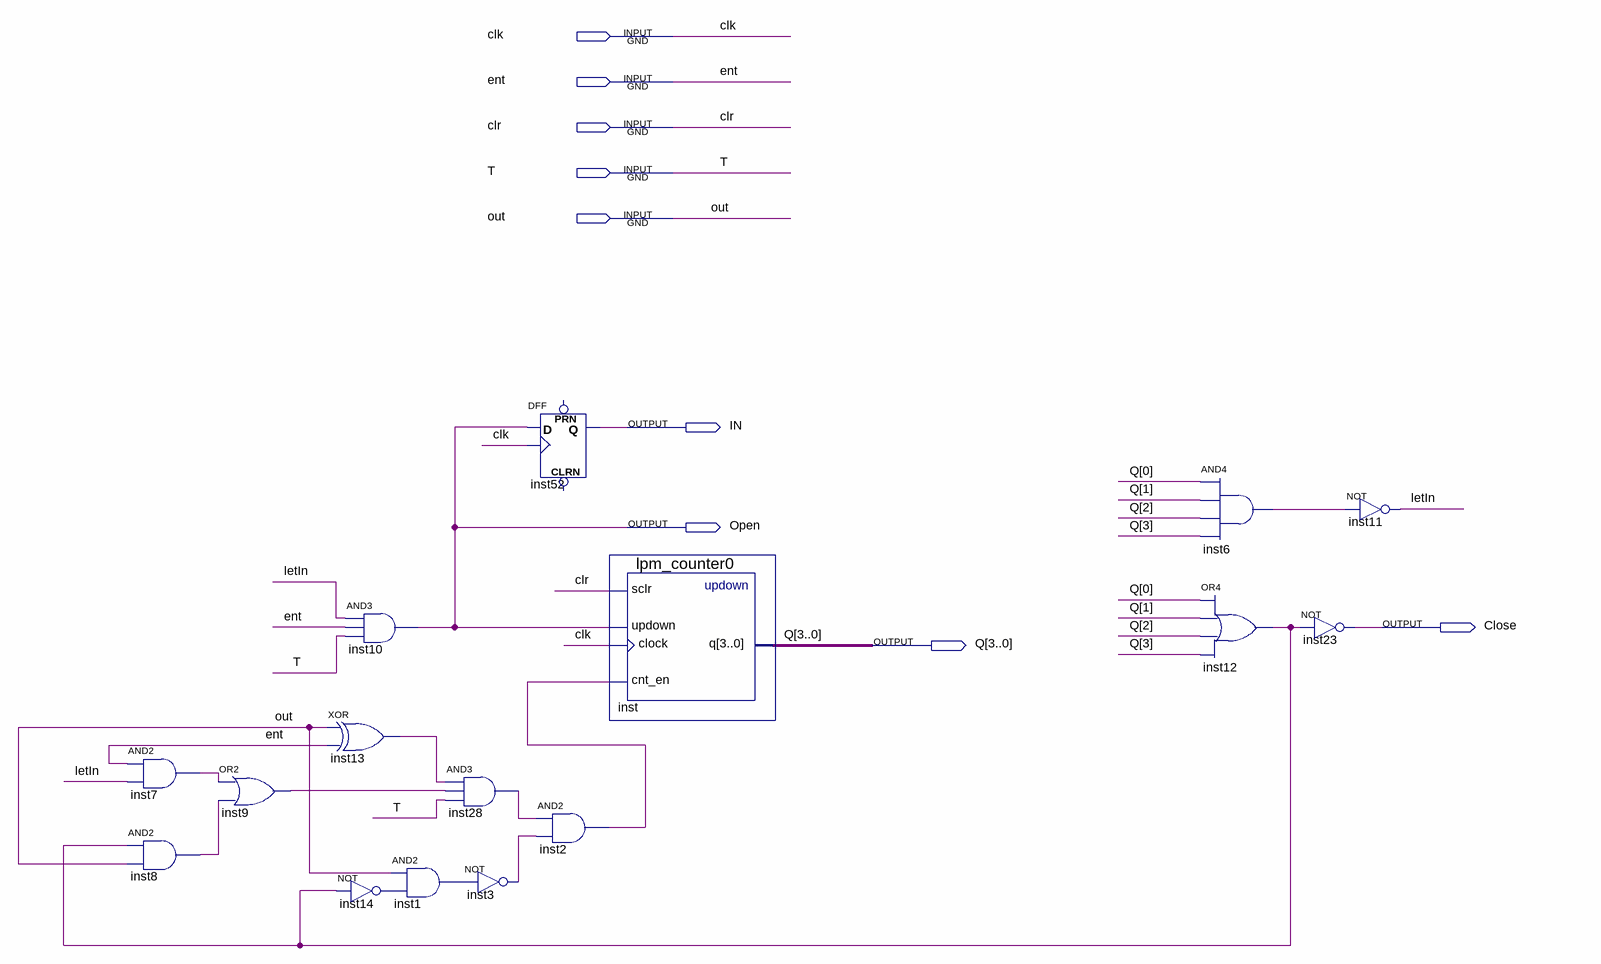
[diagram p0: schematic sheet]
// Quartus schematic main2.bdf as structural Verilog: 16 symbols, 9 pins
module main2 (
  input  clk,
  input  ent,
  input  clr,
  input  T,
  input  out,
  output IN,
  output Open,
  output Close,
  output [3:0] Q
);

  wire inst1_out, inst2_out, inst3_out, inst6_out, inst7_out, inst8_out, inst9_out, inst12_out, inst13_out,
       inst14_out, inst28_out, letIn;

  and inst7 (inst7_out, ent, letIn);
  and inst8 (inst8_out, inst12_out, out);
  or inst9 (inst9_out, inst7_out, inst8_out);
  and inst10 (Open, letIn, ent, T);
  xor inst13 (inst13_out, out, ent);
  not inst14 (inst14_out, inst12_out);
  and inst28 (inst28_out, inst13_out, inst9_out, T);
  and inst1 (inst1_out, out, inst14_out);
  not inst3 (inst3_out, inst1_out);
  DFF inst52 (.CLK(clk), .D(Open), .Q(IN));  // open: CLRN, PRN
  and inst2 (inst2_out, inst28_out, inst3_out);
  lpm_counter0 inst (.sclr(clr), .updown(Open), .clock(clk), .cnt_en(inst2_out), .q(Q));
  and inst6 (inst6_out, Q[0], Q[1], Q[2], Q[3]);
  or inst12 (inst12_out, Q[0], Q[1], Q[2], Q[3]);
  not inst23 (Close, inst12_out);
  not inst11 (letIn, inst6_out);
endmodule
